# EAGLE design PIC PCB (EAGLE 9.6.2)
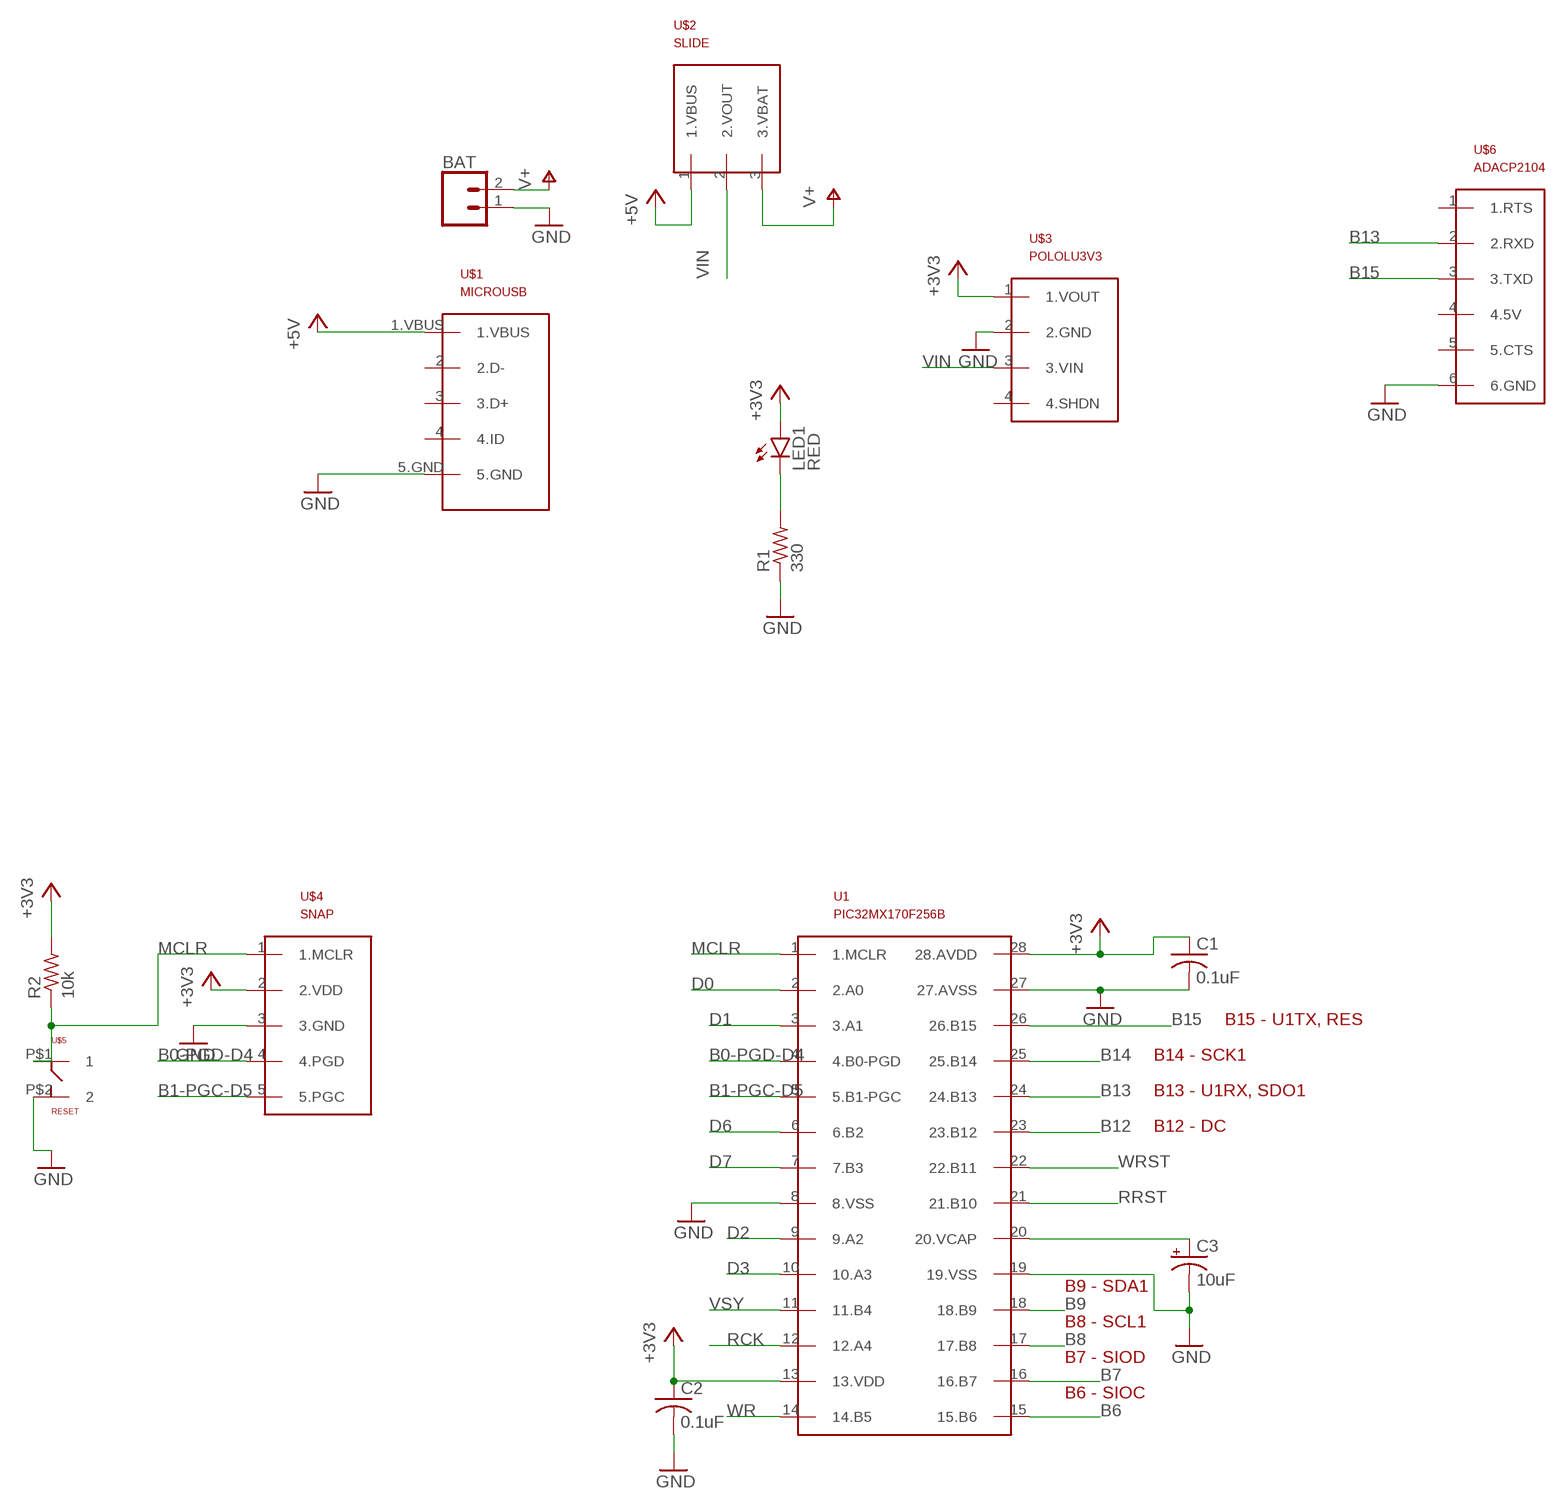
[diagram p0: schematic, sheet 1, part 1 of 2]
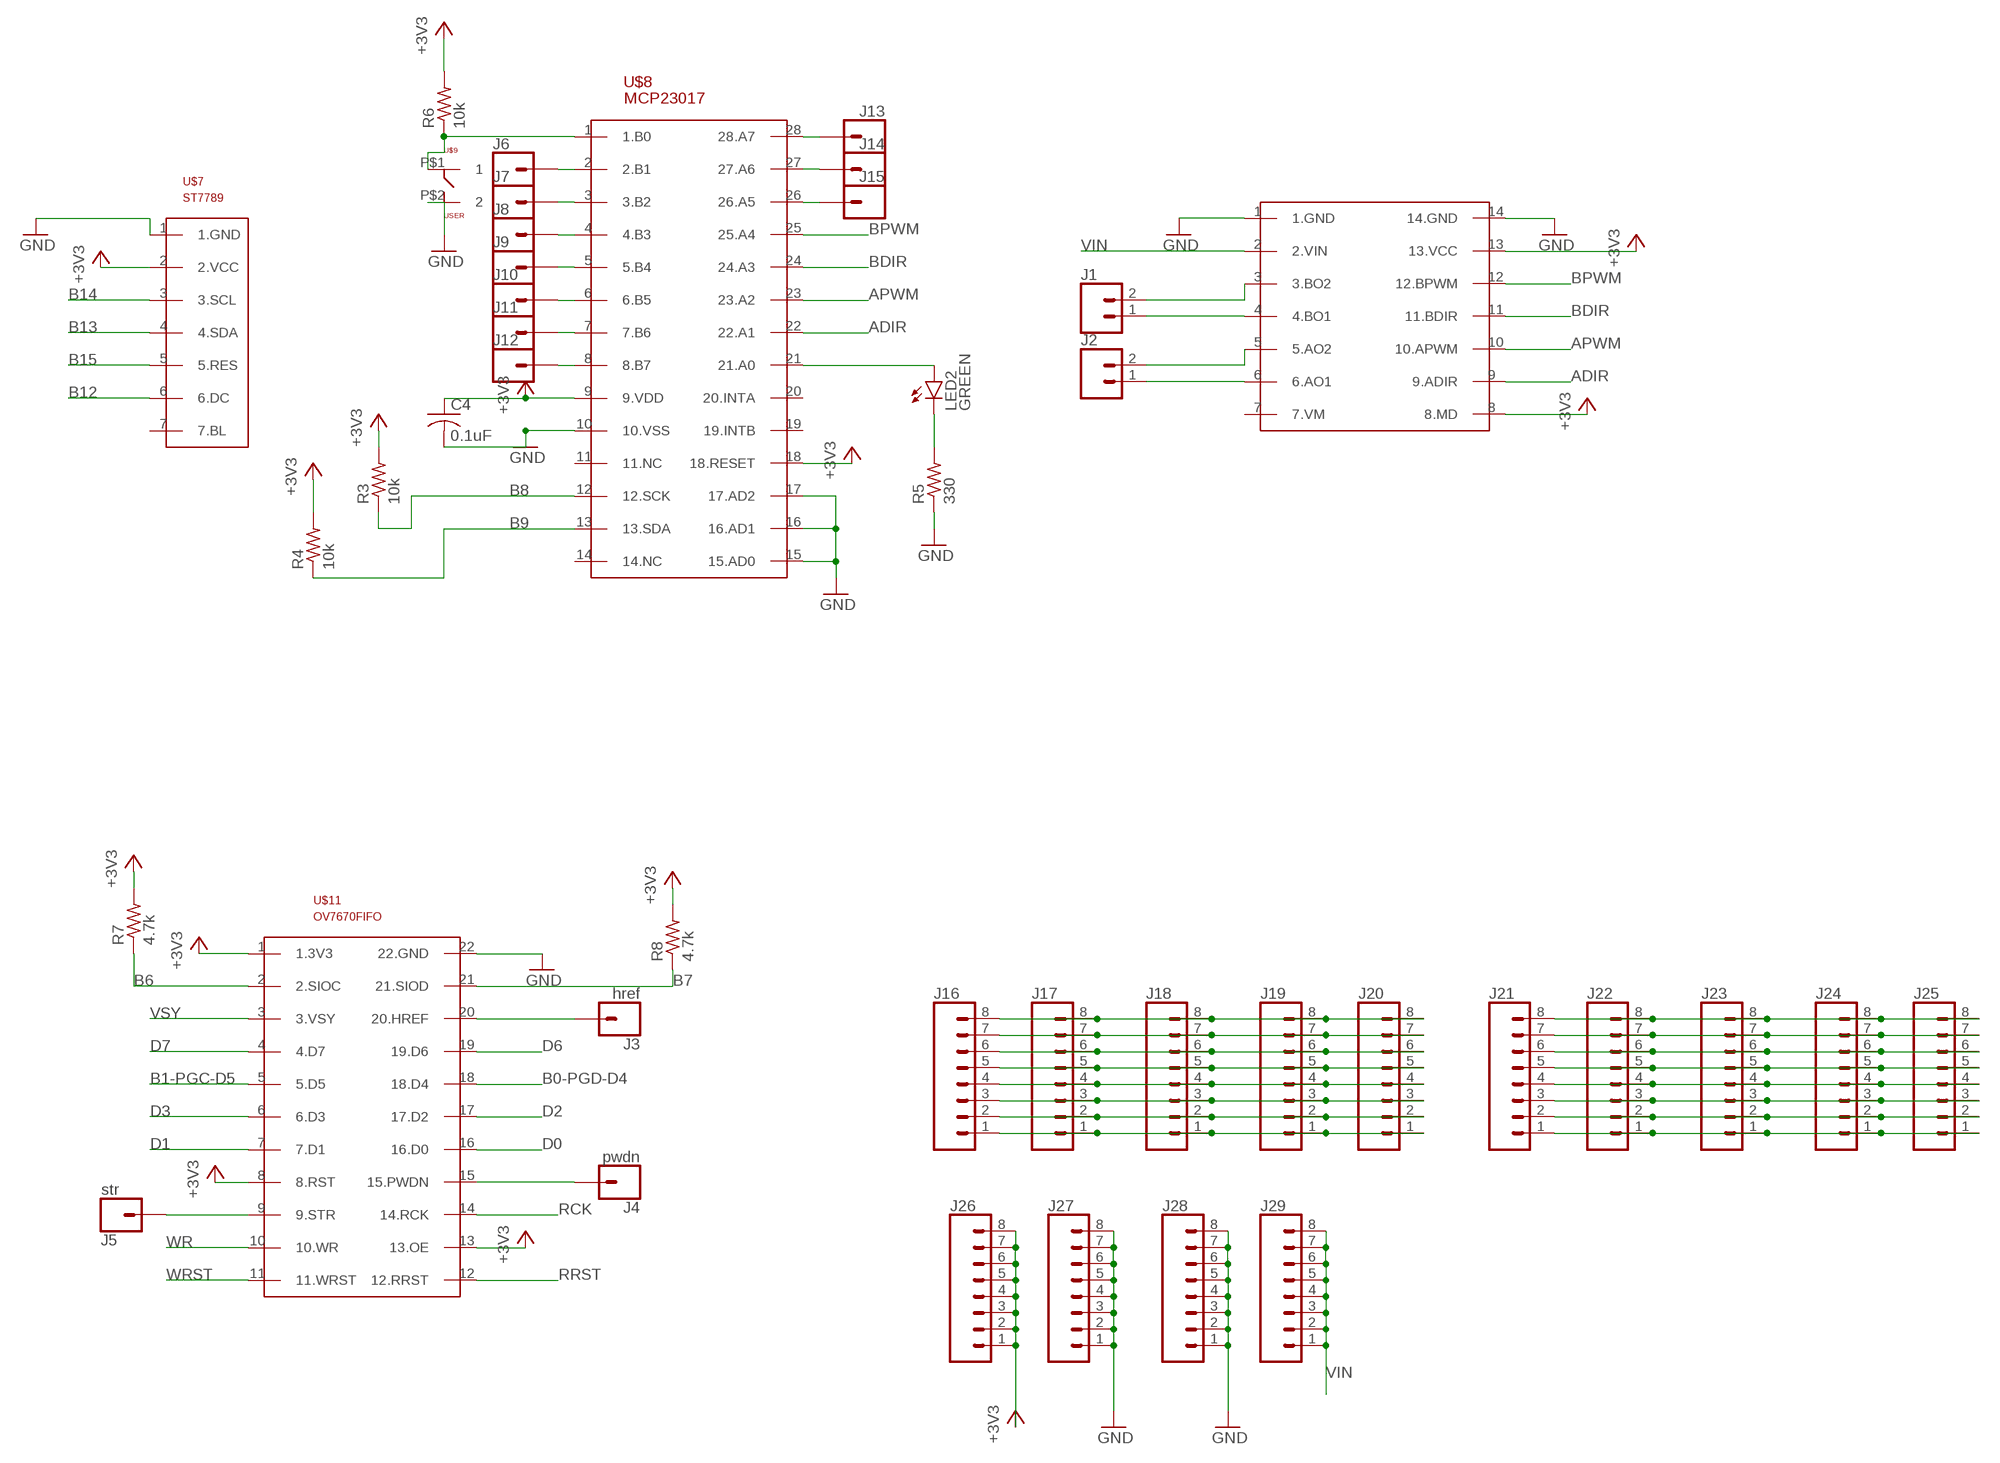
[diagram p1: schematic, sheet 1, part 2 of 2]

## Parts
BAT  CONN_02  [1X02]
C1  0.1uF  C-US025-030X050  [C025-030X050]
C2  0.1uF  C-US025-030X050  [C025-030X050]
C3  10uF  CPOL-USB45181B  [B45181B]
C4  0.1uF  C-US025-030X050  [C025-030X050]
J1  CONN_02  [1X02]
J2  CONN_02  [1X02]
J3  href  CONN_01  [1X01]
J4  pwdn  CONN_01  [1X01]
J5  str  CONN_01  [1X01]
J6  CONN_01  [1X01]
J7  CONN_01  [1X01]
J8  CONN_01  [1X01]
J9  CONN_01  [1X01]
J10  CONN_01  [1X01]
J11  CONN_01  [1X01]
J12  CONN_01  [1X01]
J13  CONN_01  [1X01]
J14  CONN_01  [1X01]
J15  CONN_01  [1X01]
J16  CONN_08"  [1X08]
J17  CONN_08"  [1X08]
J18  CONN_08"  [1X08]
J19  CONN_08"  [1X08]
J20  CONN_08"  [1X08]
J21  CONN_08"  [1X08]
J22  CONN_08"  [1X08]
J23  CONN_08"  [1X08]
J24  CONN_08"  [1X08]
J25  CONN_08"  [1X08]
J26  CONN_08"  [1X08]
J27  CONN_08"  [1X08]
J28  CONN_08"  [1X08]
J29  CONN_08"  [1X08]
LED1  RED  LED3MM  [LED3MM]
LED2  GREEN  LED3MM  [LED3MM]
R1  330  R-US_0207/10  [0207/10]
R2  10k  R-US_0207/10  [0207/10]
R3  10k  R-US_0207/10  [0207/10]
R4  10k  R-US_0207/10  [0207/10]
R5  330  R-US_0207/10  [0207/10]
R6  10k  R-US_0207/10  [0207/10]
R7  4.7k  R-US_0207/10  [0207/10]
R8  4.7k  R-US_0207/10  [0207/10]
U1  PIC32MX170F256B  [DIL28-3]
U$1  MICROUSB  [MICROUSB]
U$2  SLIDE  [SLIDE]
U$3  POLOLU3V3  [POLOLU3V3]
U$4  SNAP  [SNAP]
U$5  RESET  PUSH  [PUSH]
U$6  ADACP2104  [ADACP2104]
U$7  ST7789  [ST7789]
U$8  MCP23017  [MCP23017]
U$9  USER  PUSH  [PUSH]
U$10  POLOLUDRV8835  [POLOLUDRV8835]
U$11  OV7670FIFO  [OV7670FIFO]

## Nets
+3V3: C1.1 C2.1 C4.1 J26.1 J26.2 J26.3 J26.4 J26.5 J26.6 J26.7 J26.8 LED1.A R2.2 R3.2 R4.2 R6.2 R7.2 R8.2 U1.13(13.VDD) U1.28(28.AVDD) U$3.1(1.VOUT) U$4.2(2.VDD) U$7.2(2.VCC) U$8.9(9.VDD) U$8.18(18.RESET) U$10.8(8.MD) U$10.13(13.VCC) U$11.1(1.3V3) U$11.8(8.RST) U$11.13(13.OE)
+5V: U$1.1.VBUS U$2.1(1.VBUS)
ADIR: U$8.22(22.A1) U$10.9(9.ADIR)
APWM: U$8.23(23.A2) U$10.10(10.APWM)
B0-PGD-D4: U1.4(4.B0-PGD) U$4.4(4.PGD) U$11.18(18.D4)
B1-PGC-D5: U1.5(5.B1-PGC) U$4.5(5.PGC) U$11.5(5.D5)
B6: R7.1 U1.15(15.B6) U$11.2(2.SIOC)
B7: R8.1 U1.16(16.B7) U$11.21(21.SIOD)
B8: R3.1 U1.17(17.B8) U$8.12(12.SCK)
B9: R4.1 U1.18(18.B9) U$8.13(13.SDA)
B12: U1.23(23.B12) U$7.6(6.DC)
B13: U1.24(24.B13) U$6.2(2.RXD) U$7.4(4.SDA)
B14: U1.25(25.B14) U$7.3(3.SCL)
B15: U1.26(26.B15) U$6.3(3.TXD) U$7.5(5.RES)
BDIR: U$8.24(24.A3) U$10.11(11.BDIR)
BPWM: U$8.25(25.A4) U$10.12(12.BPWM)
D0: U1.2(2.A0) U$11.16(16.D0)
D1: U1.3(3.A1) U$11.7(7.D1)
D2: U1.9(9.A2) U$11.17(17.D2)
D3: U1.10(10.A3) U$11.6(6.D3)
D6: U1.6(6.B2) U$11.19(19.D6)
D7: U1.7(7.B3) U$11.4(4.D7)
GND: BAT.1 C1.2 C2.2 C3.- C4.2 J27.1 J27.2 J27.3 J27.4 J27.5 J27.6 J27.7 J27.8 J28.1 J28.2 J28.3 J28.4 J28.5 J28.6 J28.7 J28.8 R1.1 R5.1 U1.8(8.VSS) U1.19(19.VSS) U1.27(27.AVSS) U$1.5.GND U$3.2(2.GND) U$4.3(3.GND) U$5.P$2 U$6.6(6.GND) U$7.1(1.GND) U$8.10(10.VSS) U$8.15(15.AD0) U$8.16(16.AD1) U$8.17(17.AD2) U$9.P$2 U$10.1(1.GND) U$10.14(14.GND) U$11.22(22.GND)
MCLR: R2.1 U1.1(1.MCLR) U$4.1(1.MCLR) U$5.P$1
N$1: LED1.K(C) R1.2
N$2: C3.+ U1.20(20.VCAP)
N$3: J1.2 U$10.3(3.BO2)
N$4: LED2.A U$8.21(21.A0)
N$5: R6.1 U$8.1(1.B0) U$9.P$1
N$6: LED2.K(C) R5.2
N$7: J1.1 U$10.4(4.BO1)
N$8: J2.2 U$10.5(5.AO2)
N$9: J2.1 U$10.6(6.AO1)
N$10: J3.1 U$11.20(20.HREF)
N$11: J4.1 U$11.15(15.PWDN)
N$12: J5.1 U$11.9(9.STR)
N$13: J13.1 U$8.28(28.A7)
N$14: J14.1 U$8.27(27.A6)
N$15: J15.1 U$8.26(26.A5)
N$16: J6.1 U$8.2(2.B1)
N$17: J7.1 U$8.3(3.B2)
N$18: J8.1 U$8.4(4.B3)
N$19: J9.1 U$8.5(5.B4)
N$20: J10.1 U$8.6(6.B5)
N$21: J11.1 U$8.7(7.B6)
N$22: J12.1 U$8.8(8.B7)
N$23: J16.8 J17.8 J18.8 J19.8 J20.8
N$24: J16.7 J17.7 J18.7 J19.7 J20.7
N$25: J16.6 J17.6 J18.6 J19.6 J20.6
N$26: J16.5 J17.5 J18.5 J19.5 J20.5
N$27: J16.4 J17.4 J18.4 J19.4 J20.4
N$28: J16.3 J17.3 J18.3 J19.3 J20.3
N$29: J16.2 J17.2 J18.2 J19.2 J20.2
N$30: J16.1 J17.1 J18.1 J19.1 J20.1
N$31: J21.8 J22.8 J23.8 J24.8 J25.8
N$32: J21.7 J22.7 J23.7 J24.7 J25.7
N$33: J21.6 J22.6 J23.6 J24.6 J25.6
N$34: J21.5 J22.5 J23.5 J24.5 J25.5
N$35: J21.4 J22.4 J23.4 J24.4 J25.4
N$36: J21.3 J22.3 J23.3 J24.3 J25.3
N$37: J21.2 J22.2 J23.2 J24.2 J25.2
N$38: J21.1 J22.1 J23.1 J24.1 J25.1
RCK: U1.12(12.A4) U$11.14(14.RCK)
RRST: U1.21(21.B10) U$11.12(12.RRST)
V+: BAT.2 U$2.3(3.VBAT)
VIN: J29.1 J29.2 J29.3 J29.4 J29.5 J29.6 J29.7 J29.8 U$2.2(2.VOUT) U$3.3(3.VIN) U$10.2(2.VIN)
VSY: U1.11(11.B4) U$11.3(3.VSY)
WR: U1.14(14.B5) U$11.10(10.WR)
WRST: U1.22(22.B11) U$11.11(11.WRST)
Unconnected: U$1.2(2.D-) U$1.3(3.D+) U$1.4(4.ID) U$3.4(4.SHDN) U$6.1(1.RTS) U$6.4(4.5V) U$6.5(5.CTS) U$7.7(7.BL) U$8.11(11.NC) U$8.14(14.NC) U$8.19(19.INTB) U$8.20(20.INTA) U$10.7(7.VM)

## Notes on the sheet
- B15 - U1TX, RES
- B14 - SCK1
- B13 - U1RX, SDO1
- B12 - DC
- B9 - SDA1
- B8 - SCL1
- B7 - SIOD
- B6 - SIOC

## Library data of the parts
BAT J1 J2 = PIC PCB:CONN_02: Multi connection point. Often used as Generic Header-pin footprint for 0.1 inch spaced/style header connections On any of the 0.1 inch spaced packages, you can populate with these: Break Away Headers - Straight <https://www.sparkfun.com/products/116> (PRT-00116) Break Away Male Headers - Right Angle <https://www.sparkfun.com/products/553> (PRT-00553) Female Headers <https://www.sparkfun.com/products/115> (PRT-00115) Break Away Headers - Machine Pin <https://www.sparkfun.com/products/117> (PRT-00117) Break Away Female Headers - Swiss Machine Pin <https://www.sparkfun.com/products/743> (PRT-00743) For SCREWTERMINALS and SPRING TERMINALS visit here: Screw Terimnals on SparkFun.com <https://www.sparkfun.com/search/results?term=Screw+Terminals> (5mm/3.5mm/2.54mm spacing) This device is also useful as a general connection point to wire up your design to another part of your project. Our various solder wires solder well into these plated through hole pads. Hook-Up Wire - Assortment (Stranded, 22 AWG) <https://www.sparkfun.com/products/11375> (PRT-11375) Hook-Up Wire - Assortment (Solid Core, 22 AWG) <https://www.sparkfun.com/products/11367> (PRT-11367) View the entire wire category on our website here <https://www.sparkfun.com/categories/141> Special notes: Molex polarized connector foot print use with: PRT-08233 with associated crimp pins and housings. 2.54_SCREWTERM for use with PRT-10571. 3.5mm Screw Terminal footprints for PRT-08084 5mm Screw Terminal footprints for use with PRT-08432
C1 C2 C4 = PIC PCB:C-US: CAPACITOR, American symbol; SPICEPREFIX: C
C3 = PIC PCB:CPOL-US: POLARIZED CAPACITOR, American symbol; SPICEPREFIX: C
J3-J15 = PIC PCB:CONN_01: Single connection point. Often used as Generic Header-pin footprint for 0.1 inch spaced/style header connections On any of the 0.1 inch spaced packages, you can populate with these: Break Away Headers - Straight <https://www.sparkfun.com/products/116> (PRT-00116) Break Away Male Headers - Right Angle <https://www.sparkfun.com/products/553> (PRT-00553) Female Headers <https://www.sparkfun.com/products/115> (PRT-00115) Break Away Headers - Machine Pin <https://www.sparkfun.com/products/117> (PRT-00117) Break Away Female Headers - Swiss Machine Pin <https://www.sparkfun.com/products/743> (PRT-00743) This device is also useful as a general connection point to wire up your design to another part of your project. Our various solder wires solder well into these plated through hole pads. Hook-Up Wire - Assortment (Stranded, 22 AWG) <https://www.sparkfun.com/products/11375> (PRT-11375) Hook-Up Wire - Assortment (Solid Core, 22 AWG) <https://www.sparkfun.com/products/11367> (PRT-11367) View the entire wire category on our website here <https://www.sparkfun.com/categories/141> Special notes: SMTSO-256-ET is a "flush mount" nut for a 4-40 screw. We mostly use this on specialty testbeds; it is a nice way to connect hardware to your PCB at an adjustable hieght. Also note, the SNAP packages are for using a snappable style connector. We sell a baggie of snaps and they are also used on two LilyPad designs: Snap Assortment - 30 pack (male and female) <https://www.sparkfun.com/products/11347> (DEV-11347) LilyPad Arduino SimpleSnap <https://www.sparkfun.com/products/10941> (DEV-10941) LilyPad SimpleSnap Protoboard <https://www.sparkfun.com/products/10940> (DEV-10940)
J16-J29 = PIC PCB:CONN_08: Multi connection point. Often used as Generic Header-pin footprint for 0.1 inch spaced/style header connections On any of the 0.1 inch spaced packages, you can populate with these: Break Away Headers - Straight <https://www.sparkfun.com/products/116> (PRT-00116) Break Away Male Headers - Right Angle <https://www.sparkfun.com/products/553> (PRT-00553) Female Headers <https://www.sparkfun.com/products/115> (PRT-00115) Break Away Headers - Machine Pin <https://www.sparkfun.com/products/117> (PRT-00117) Break Away Female Headers - Swiss Machine Pin <https://www.sparkfun.com/products/743> (PRT-00743) Arduino Stackable Header - 8 Pin <https://www.sparkfun.com/products/9279> (PRT-09279) For SCREWTERMINALS and SPRING TERMINALS visit here: Screw Terimnals on SparkFun.com <https://www.sparkfun.com/search/results?term=Screw+Terminals> (5mm/3.5mm/2.54mm spacing) This device is also useful as a general connection point to wire up your design to another part of your project. Our various solder wires solder well into these plated through hole pads. Hook-Up Wire - Assortment (Stranded, 22 AWG) <https://www.sparkfun.com/products/11375> (PRT-11375) Hook-Up Wire - Assortment (Solid Core, 22 AWG) <https://www.sparkfun.com/products/11367> (PRT-11367) View the entire wire category on our website here <https://www.sparkfun.com/categories/141> Special notes: Molex polarized connector foot print use with SKU : PRT-08231 with associated crimp pins and housings. 1MM SMD Version SKU: PRT-10208 NOTES ON THE VARIANTS LOCK and LOCK_LONGPADS... This footprint was designed to help hold the alignment of a through-hole component (i.e. 6-pin header) while soldering it into place. You may notice that each hole has been shifted either up or down by 0.005 of an inch from it's more standard position (which is a perfectly straight line). This slight alteration caused the pins (the squares in the middle) to touch the edges of the holes. Because they are alternating, it causes a "brace" to hold the component in place. 0.005 has proven to be the perfect amount of "off-center" position when using our standard breakaway headers. Although looks a little odd when you look at the bare footprint, once you have a header in there, the alteration is very hard to notice. Also,if you push a header all the way into place, it is covered up entirely on the bottom side.; PROD_ID: CONN-08438
LED1 LED2 = PIC PCB:LED: LED OSRAM: - CHIPLED LG R971, LG N971, LY N971, LG Q971, LY Q971, LO R971, LY R971 LH N974, LH R974 LS Q976, LO Q976, LY Q976 LO Q996 - Hyper CHIPLED LW Q18S LB Q993, LB Q99A, LB R99A - SideLED LS A670, LO A670, LY A670, LG A670, LP A670 LB A673, LV A673, LT A673, LW A673 LH A674 LY A675 LS A676, LA A676, LO A676, LY A676, LW A676 LS A679, LY A679, LG A679 - Hyper Micro SIDELED® LS Y876, LA Y876, LO Y876, LY Y876 LT Y87S - SmartLED LW L88C, LW L88S LB L89C, LB L89S, LG L890 LS L89K, LO L89K, LY L89K LS L896, LA L896, LO L896, LY L896 - TOPLED LS T670, LO T670, LY T670, LG T670, LP T670 LSG T670, LSP T670, LSY T670, LOP T670, LYG T670 LG T671, LOG T671, LSG T671 LB T673, LV T673, LT T673, LW T673 LH T674 LS T676, LA T676, LO T676, LY T676, LB T676, LH T676, LSB T676, LW T676 LB T67C, LV T67C, LT T67C, LS T67K, LO T67K, LY T67K, LW E67C LS E67B, LA E67B, LO E67B, LY E67B, LB E67C, LV E67C, LT E67C LW T67C LS T679, LY T679, LG T679 LS T770, LO T770, LY T770, LG T770, LP T770 LB T773, LV T773, LT T773, LW T773 LH T774 LS E675, LA E675, LY E675, LS T675 LS T776, LA T776, LO T776, LY T776, LB T776 LHGB T686 LT T68C, LB T68C - Hyper Mini TOPLED® LB M676 - Mini TOPLED Santana® LG M470 LS M47K, LO M47K, LY M47K Source: http://www.osram.convergy.de LUXEON: - LUMILED® LXK2-PW12-R00, LXK2-PW12-S00, LXK2-PW14-U00, LXK2-PW14-V00 LXK2-PM12-R00, LXK2-PM12-S00, LXK2-PM14-U00 LXK2-PE12-Q00, LXK2-PE12-R00, LXK2-PE12-S00, LXK2-PE14-T00, LXK2-PE14-U00 LXK2-PB12-K00, LXK2-PB12-L00, LXK2-PB12-M00, LXK2-PB14-N00, LXK2-PB14-P00, LXK2-PB14-Q00 LXK2-PR12-L00, LXK2-PR12-M00, LXK2-PR14-Q00, LXK2-PR14-R00 LXK2-PD12-Q00, LXK2-PD12-R00, LXK2-PD12-S00 LXK2-PH12-R00, LXK2-PH12-S00 LXK2-PL12-P00, LXK2-PL12-Q00, LXK2-PL12-R00 Source: www.luxeon.com KINGBRIGHT: KA-3528ASYC Source: www.kingbright.com
R1-R8 = PIC PCB:R-US_: RESISTOR, American symbol; SPICEPREFIX: R
U1 = PIC PCB:PIC32MX170F256B
U$1 = PIC PCB:MICROUSB
U$2 = PIC PCB:SLIDE
U$3 = PIC PCB:POLOLU3V3
U$4 = PIC PCB:SNAP
U$5 U$9 = PIC PCB:PUSH
U$6 = PIC PCB:ADACP2104
U$7 = PIC PCB:ST7789
U$8 = PIC PCB:MCP23017
U$10 = PIC PCB:POLOLUDRV8835
U$11 = PIC PCB:OV7670FIFO

## Board
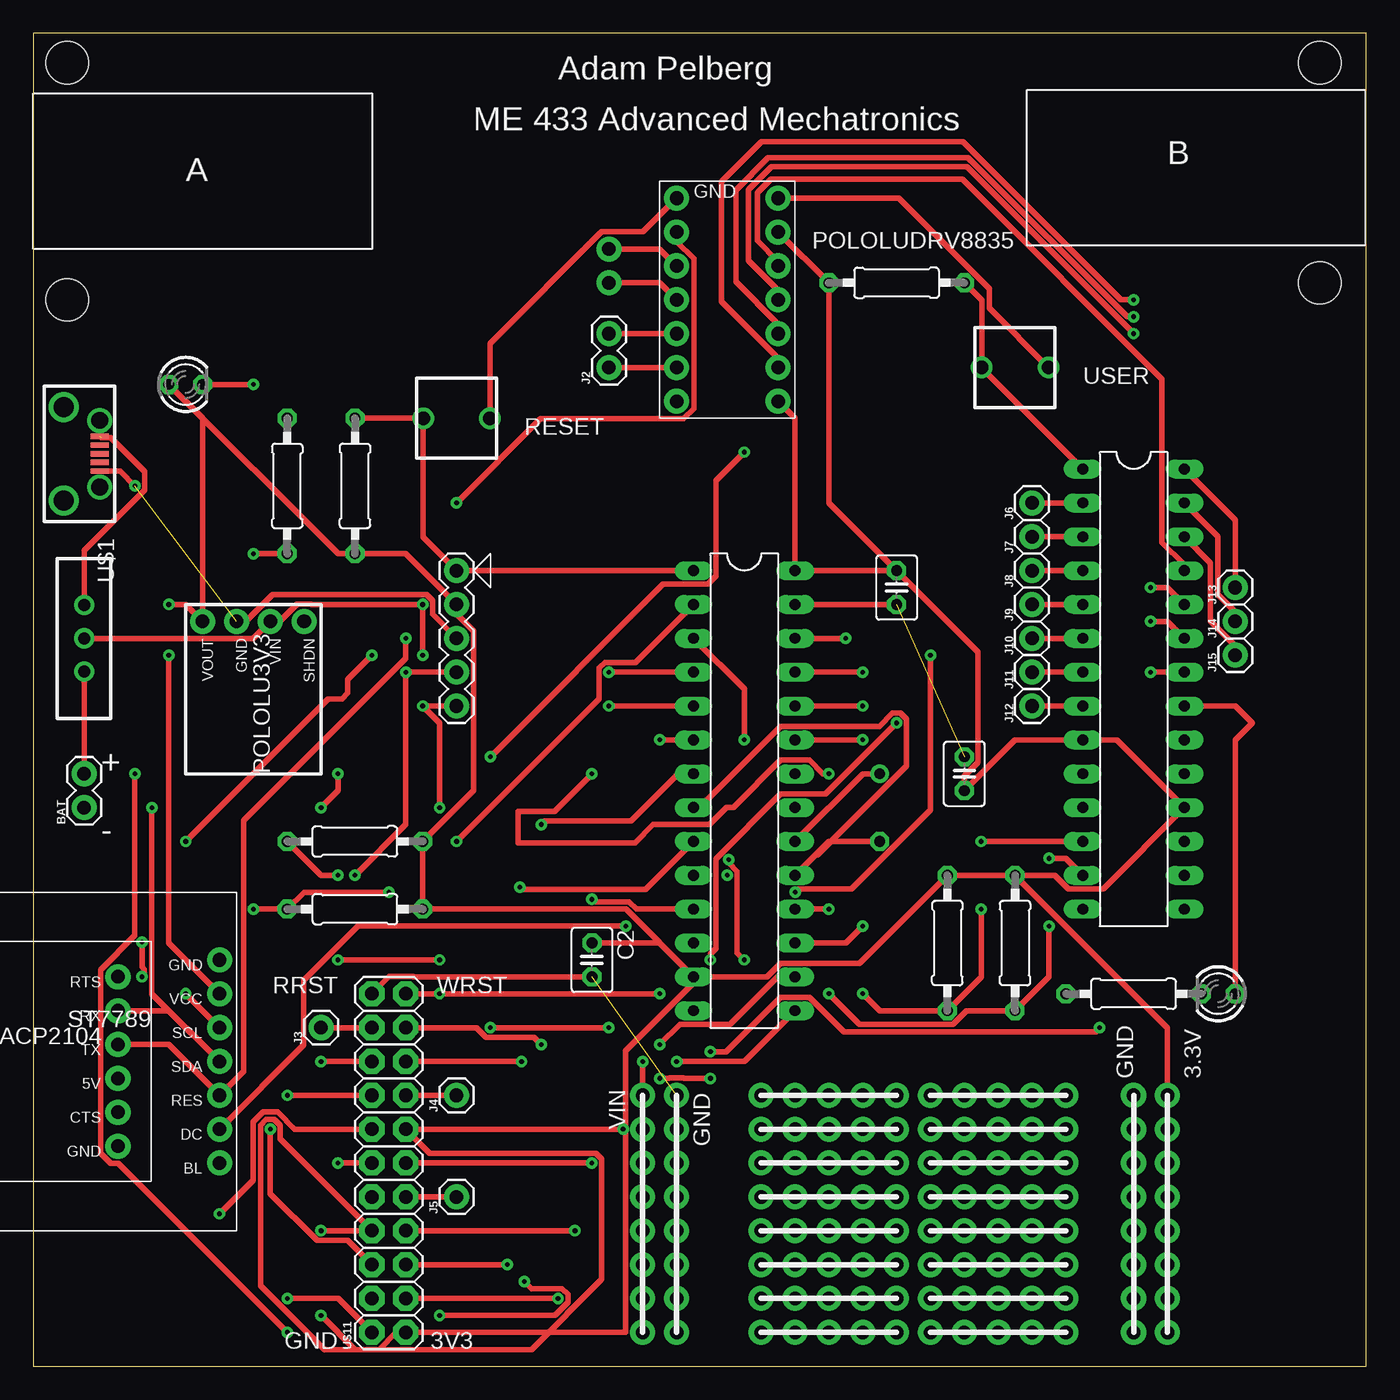
[diagram p2: board, top side]
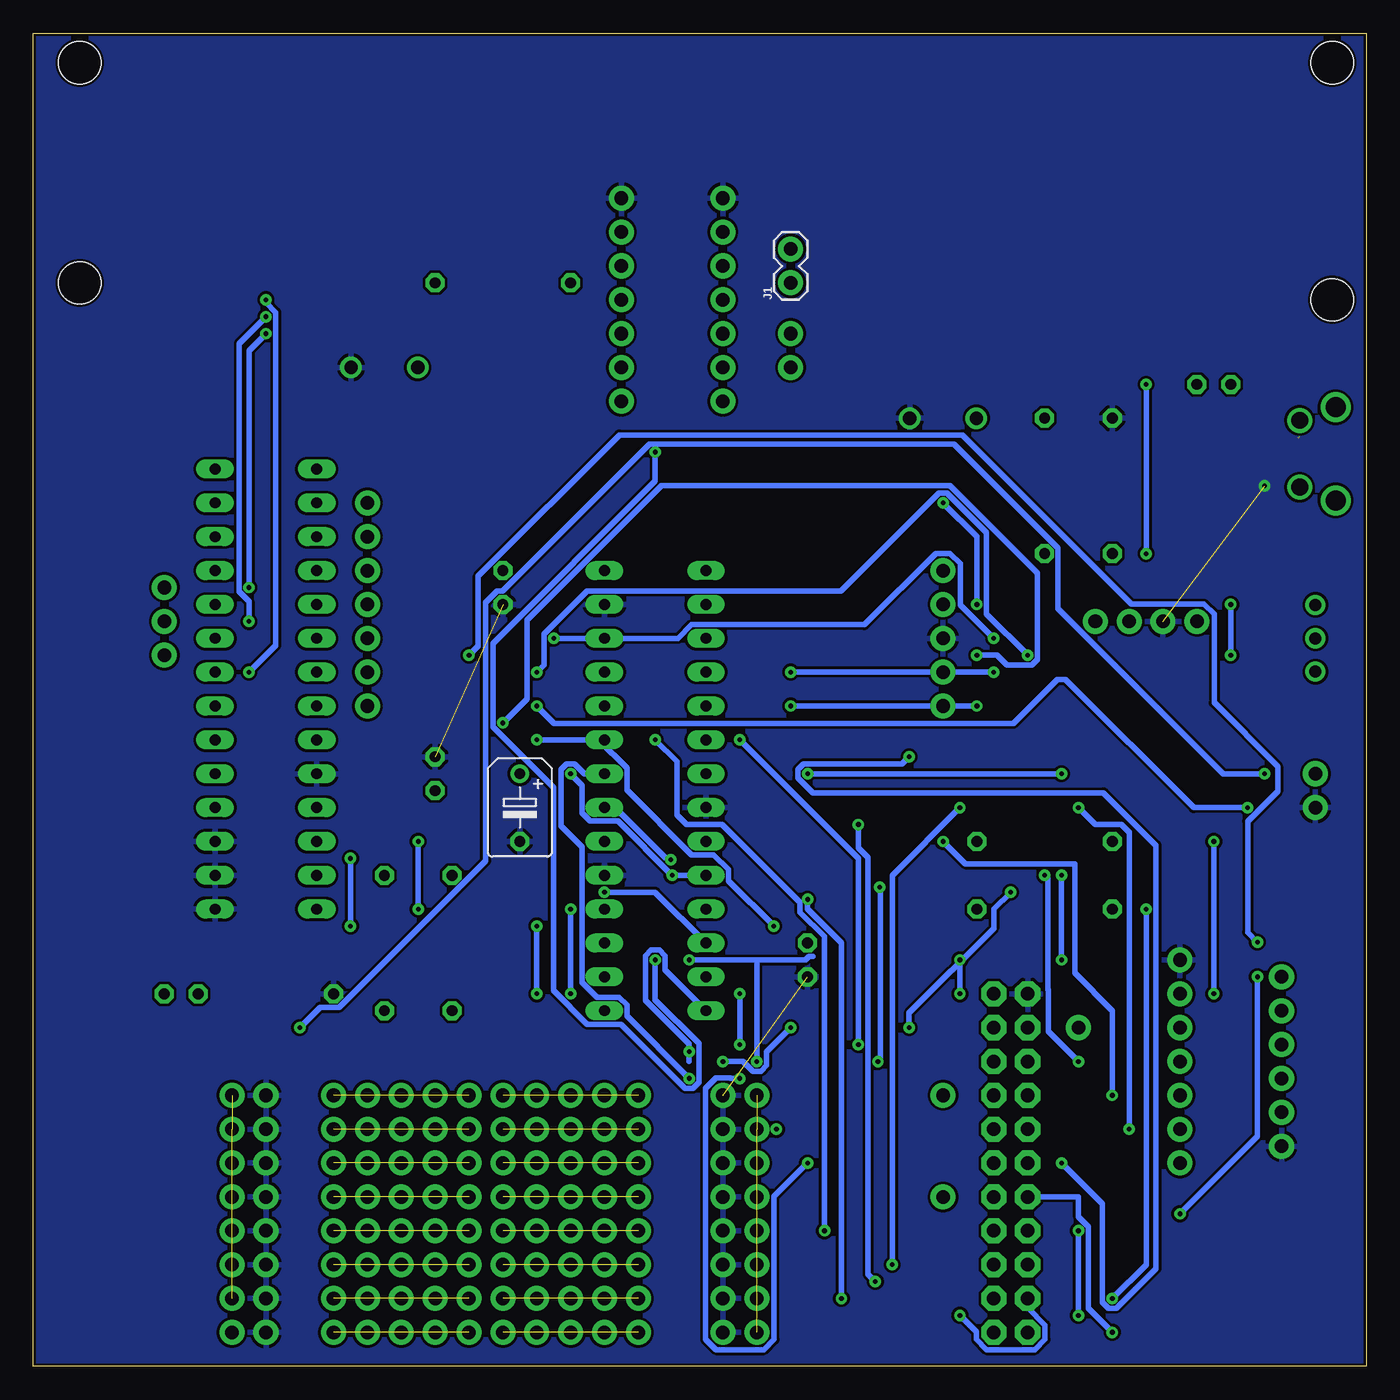
[diagram p3: board, bottom side, seen from below]

Size 100 x 100 mm. Coordinates in mm from the lower left corner, seen from the top.
Outline: 0,0 100,0 100,100 0,100 0,0
Copper layers (1*16): Top 0.035mm / dielectric 1.5mm / Bottom 0.035mm
Design rules "SparkFun": minimum track width 8mil, minimum drill 20mil, track to track 8mil, track to pad 8mil, pad to pad 8mil, via to via 8mil, smd to smd 8mil, copper to edge 8mil, drill to drill 8mil, minimum pad ring 12mil, minimum via ring 10mil, stop-mask expansion 4mil, vias tented up to drill 20mil, thermal gap 10mil
Holes 3.17 mm at 2.54,97.79 2.54,80.01 96.52,97.79 96.52,81.28

### Footprints (pad centres in the part's own frame; a part is rotated, then mirrored left to right if it is on the bottom)
1X02 = drill 1.016 pad 1.88: 1 0,0; 2 2.54,0
C025-030X050 = drill 0.813 octagon: 1 -1.27,0; 2 1.27,0
B45181B = drill 0.813: + -2.54,0 | drill 0.813 octagon: - 2.54,0
1X01 = drill 1.016 pad 1.88: 1 0,0
1X08 = drill 1.016 pad 1.88: 1 0,0; 2 2.54,0; 3 5.08,0; 4 7.62,0; 5 10.16,0; 6 12.7,0; 7 15.24,0; 8 17.78,0
LED3MM = drill 0.813 octagon: A -1.27,0; K 1.27,0
0207/10 = drill 0.813 octagon: 1 -5.08,0; 2 5.08,0
DIL28-3 = drill 0.813 long: 1 -16.51,-3.81; 2 -13.97,-3.81; 3 -11.43,-3.81; 4 -8.89,-3.81; 5 -6.35,-3.81; 6 -3.81,-3.81; 7 -1.27,-3.81; 8 1.27,-3.81; 9 3.81,-3.81; 10 6.35,-3.81; 11 8.89,-3.81; 12 11.43,-3.81; 13 13.97,-3.81; 14 16.51,-3.81; 15 16.51,3.81; 16 13.97,3.81; 17 11.43,3.81; 18 8.89,3.81; 19 6.35,3.81; 20 3.81,3.81; 21 1.27,3.81; 22 -1.27,3.81; 23 -3.81,3.81; 24 -6.35,3.81; 25 -8.89,3.81; 26 -11.43,3.81; 27 -13.97,3.81; 28 -16.51,3.81
MICROUSB = smd 0.4 x 1.35: 1.VBUS -1.3,2.7; 2 -0.65,2.7; 3 0,2.7; 4 0.65,2.7; 5.GND 1.3,2.7 | drill 1.25 pad 1.676: P$6 -2.5,2.7; P$7 2.5,2.7 | drill 1.5: P$8 -3.5,0; P$9 3.5,0
SLIDE = drill 0.9: 1 -2.5,0; 2 0,0; 3 2.5,0
POLOLU3V3 = drill 1.016 pad 1.88: 1 0,3.81; 2 0,1.27; 3 0,-1.27; 4 0,-3.81
SNAP = drill 1.016 pad 1.88: 1 0,5.08; 2 0,2.54; 3 0,0; 4 0,-2.54; 5 0,-5.08
PUSH = drill 1: P$1 -2.5,0; P$2 2.5,0
ADACP2104 = drill 1.016 pad 1.88: 1 0,6.35; 2 0,3.81; 3 0,1.27; 4 0,-1.27; 5 0,-3.81; 6 0,-6.35
ST7789 = drill 1.016 pad 1.88: 1 0,7.62; 2 0,5.08; 3 0,2.54; 4 0,0; 5 0,-2.54; 6 0,-5.08; 7 0,-7.62
MCP23017 = drill 0.813 long: 1 -16.51,-3.81; 2 -13.97,-3.81; 3 -11.43,-3.81; 4 -8.89,-3.81; 5 -6.35,-3.81; 6 -3.81,-3.81; 7 -1.27,-3.81; 8 1.27,-3.81; 9 3.81,-3.81; 10 6.35,-3.81; 11 8.89,-3.81; 12 11.43,-3.81; 13 13.97,-3.81; 14 16.51,-3.81; 15 16.51,3.81; 16 13.97,3.81; 17 11.43,3.81; 18 8.89,3.81; 19 6.35,3.81; 20 3.81,3.81; 21 1.27,3.81; 22 -1.27,3.81; 23 -3.81,3.81; 24 -6.35,3.81; 25 -8.89,3.81; 26 -11.43,3.81; 27 -13.97,3.81; 28 -16.51,3.81
POLOLUDRV8835 = drill 1.016 pad 1.88: 1 -3.81,7.62; 2 -3.81,5.08; 3 -3.81,2.54; 4 -3.81,0; 5 -3.81,-2.54; 6 -3.81,-5.08; 7 -3.81,-7.62; 8 3.81,-7.62; 9 3.81,-5.08; 10 3.81,-2.54; 11 3.81,0; 12 3.81,2.54; 13 3.81,5.08; 14 3.81,7.62
OV7670FIFO = drill 1.016 pad 1.88 octagon: 1 -1.27,12.7; 2 1.27,12.7; 3 -1.27,10.16; 4 1.27,10.16; 5 -1.27,7.62; 6 1.27,7.62; 7 -1.27,5.08; 8 1.27,5.08; 9 -1.27,2.54; 10 1.27,2.54; 11 -1.27,0; 12 1.27,0; 13 -1.27,-2.54; 14 1.27,-2.54; 15 -1.27,-5.08; 16 1.27,-5.08; 17 -1.27,-7.62; 18 1.27,-7.62; 19 -1.27,-10.16; 20 1.27,-10.16; 21 -1.27,-12.7; 22 1.27,-12.7

### Placement (x,y rotation side)
BAT  3.81,41.91 90 top
C1  64.77,58.42 270 top
C2  41.91,30.48 270 top
C3  63.5,41.91 270 bottom
C4  69.85,44.45 90 top
J1  43.18,81.28 90 bottom
J2  43.18,74.93 90 top
J3  21.59,25.4 90 top
J4  31.75,20.32 90 top
J5  31.75,12.7 90 top
J6  74.93,64.77 90 top
J7  74.93,62.23 90 top
J8  74.93,59.69 90 top
J9  74.93,57.15 90 top
J10  74.93,54.61 90 top
J11  74.93,52.07 90 top
J12  74.93,49.53 90 top
J13  90.17,58.42 90 top
J14  90.17,55.88 90 top
J15  90.17,53.34 90 top
J16  54.61,20.32 270 top
J17  57.15,20.32 270 top
J18  59.69,20.32 270 top
J19  62.23,20.32 270 top
J20  64.77,20.32 270 top
J21  67.31,20.32 270 top
J22  69.85,20.32 270 top
J23  72.39,20.32 270 top
J24  74.93,20.32 270 top
J25  77.47,20.32 270 top
J26  85.09,2.54 90 top
J27  48.26,2.54 90 top
J28  82.55,2.54 90 top
J29  45.72,2.54 90 top
LED1  11.43,73.66 0 top
LED2  88.9,27.94 180 top
R1  19.05,66.04 270 top
R2  24.13,66.04 270 top
R3  68.58,31.75 90 top
R4  73.66,31.75 90 top
R5  82.55,27.94 0 top
R6  64.77,81.28 180 top
R7  24.13,34.29 0 top
R8  24.13,39.37 0 top
U1  53.34,43.18 270 top
U$1  2.29,68.45 270 top
U$2  3.81,54.61 270 top
U$3  16.51,55.88 90 top
U$4  31.75,54.61 0 top
U$5  31.75,71.12 0 top
U$6  6.35,22.86 0 top
U$7  13.97,22.86 0 top
U$8  82.55,50.8 270 top
U$9  73.66,74.93 0 top
U$10  52.07,80.01 0 top
U$11  26.67,15.24 180 top

### Tracks (layer width: path | path; a pad name or v marks a point on that pad's centre or on a via)
+3V3  (via drill 0.35)  (6 unrouted)
  Top 0.406: U1.13 44.45,34.29 R7.2 R8.2 33.05,43.2 33.05,55.15 31.75,56.44 U$4.2 27.94,60.96 R2.2 22.86,60.96 LED1.A 12.7,71.12 U$3.1 11.43,57.15 v10.16,57.15 | U1.13 55.05,29.21 56.07,30.23 61.98,30.23 R3.2 R4.2 | U$10.8 57.15,71.12 U1.28 C1.1 | C1.1 59.69,64.77 R6.2 U$10.13 | C1.1 70.87,53.59 70.87,45.3 69.85,44.28 C4.1 73.66,46.99 U$8.9 81.28,46.99 U$8.18 80.26,35.81 77.66,35.81 76.64,36.83 R4.2 | R4.2 85.09,25.4 J26.8 J26.1 | U1.13 49.53,28.77 44.42,23.66 44.42,2.54 U$11.1 27.23,2.54 25.94,1.25 | 25.94,1.25 24.16,1.25 | 24.16,1.25 v21.59,3.81 | v21.59,10.16 U$11.8 18.51,17.05 18.51,18.08 18.08,18.51 17.48,18.51 17.05,18.08 17.05,6.05 21.85,1.25 24.16,1.25 | C2.1 46.99,31.75 U1.13 | U$7.2 10.16,31.75 v10.16,53.34 | v44.25,17.78 U$11.13 29.75,15.97 42.21,15.97 42.64,15.54 42.64,6.53 37.36,1.25 25.94,1.25
  Bottom 0.406: v21.59,3.81 v21.59,10.16 | v10.16,53.34 v10.16,57.15
+5V  (1 unrouted)
  Top 0.406: 5.08,69.66 5.81,69.66 8.35,67.11 8.35,65.74 3.81,61.19 U$2.1
ADIR  (via drill 0.35)
  Top 0.406: v82.55,80.01 81.59,80.01 69.73,91.87 54.65,91.87 51.64,88.86 51.64,79.88 55.88,75.64 U$10.9 | v83.82,52.07 U$8.22
  Bottom 0.406: v82.55,80.01 82.55,79.78 81.82,79.04 81.82,54.07 v83.82,52.07
APWM  (via drill 0.35)
  Top 0.406: v82.55,78.74 82.07,78.74 70.13,90.68 55.13,90.68 52.7,88.25 52.7,81.35 55.88,78.18 U$10.10 | v83.82,55.88 85.09,55.88 U$8.23
  Bottom 0.406: v83.82,55.88 83.82,57.38 84.55,58.12 84.55,76.74 v82.55,78.74
B0-PGD-D4  (via drill 0.35)
  Top 0.406: U$4.4 v27.94,52.07 27.94,40.64 v24.13,36.83 | v43.18,52.07 U1.4 | v21.59,22.86 U$11.18
  Bottom 0.406: v27.94,52.07 v43.18,52.07 | v24.13,36.83 23.88,36.58 23.88,28.25 23.85,28.22 23.85,25.12 v21.59,22.86
  other vias: 31.75,52.07 31.75,52.07
B1-PGC-D5  (via drill 0.35)
  Top 0.406: U$4.5 v29.21,49.53 30.48,48.26 v30.48,41.91 | v43.18,49.53 U1.5 | U$11.5 v35.56,7.62
  Bottom 0.406: v29.21,49.53 v43.18,49.53 | v30.48,41.91 35.56,36.83 v35.56,7.62
B6  (via drill 0.35)
  Top 0.406: U$11.2 22.86,5.08 v19.05,5.08 | v16.51,34.29 R7.1 20.32,35.56 v26.67,35.56 | v34.29,25.4 v43.18,25.4 | v48.26,22.86 53.34,22.86 U1.15
  Bottom 0.406: v19.05,5.08 16.51,7.62 v16.51,34.29 | v26.67,35.56 27.94,34.29 27.94,32.85 34.29,26.5 v34.29,25.4 | v48.26,22.86 46.76,22.86 46.02,22.13 45.42,22.13 44.99,22.56 44.99,23.59 v43.18,25.4
B7  (via drill 0.35)
  Top 0.406: R8.1 21.59,36.83 v22.86,36.83 | v22.86,30.48 v30.48,30.48 | U$11.21 v30.48,27.94 v46.99,27.94 | v46.99,24.13 48.51,25.65 52.29,25.65 55.84,29.21 U1.16
  Bottom 0.406: v22.86,36.83 v22.86,30.48 | v30.48,30.48 v30.48,27.94 | v46.99,27.94 v46.99,24.13
B8  (via drill 0.35)
  Top 0.406: v62.23,27.94 63.5,26.67 R3.1 71.12,29.21 v71.12,34.29 | v62.23,33.02 60.96,31.75 U1.17 | v71.12,39.37 U$8.12
  Bottom 0.406: v62.23,27.94 v62.23,33.02 | v71.12,34.29 v71.12,39.37
B9  (via drill 0.35)
  Top 0.406: v76.2,33.02 76.2,29.21 R4.1 70.02,26.67 69,25.65 61.98,25.65 v59.69,27.94 | v76.2,38.1 77.47,38.1 U$8.13 | v59.69,34.29 U1.18
  Bottom 0.406: v76.2,33.02 v76.2,38.1 | v59.69,27.94 v59.69,34.29
B12  (via drill 0.35)
  Top 0.406: U$7.6 20.3,24.11 20.3,28.95 24.36,33.02 v44.45,33.02 | v62.23,46.99 U1.23
  Bottom 0.406: v44.45,33.02 47.85,36.42 47.85,37.25 48.96,38.35 50.61,38.35 55.47,43.22 55.47,44.87 57.59,46.99 v62.23,46.99
B13  (via drill 0.35)
  Top 0.406: U$6.2 10.16,26.67 U$7.4 8.89,27.94 v8.89,41.91 | v62.23,49.53 U1.24
  Bottom 0.406: v8.89,41.91 12.93,41.91 22.56,51.53 23.16,51.53 26.46,48.23 60.94,48.23 v62.23,49.53
B14  (via drill 0.35)
  Top 0.406: U$7.3 v11.43,27.94 | v11.43,39.37 22.13,50.07 23.16,50.07 23.59,50.5 23.59,51.53 v25.4,53.34 | v62.23,52.07 U1.25
  Bottom 0.406: v11.43,27.94 v11.43,39.37 | v25.4,53.34 28.48,56.42 28.48,62.53 31.45,65.5 32.05,65.5 39.39,58.17 58.44,58.17 61.69,54.91 61.69,52.61 v62.23,52.07
B15  (via drill 0.35)
  Top 0.406: U$6.3 10.16,24.13 U$7.5 15.78,22.13 15.78,40.94 27.94,53.11 v27.94,54.61 | v60.96,54.61 U1.26
  Bottom 0.406: v60.96,54.61 51.63,54.61 50.61,55.63 37.65,55.63 32.29,60.98 31.21,60.98 30.45,60.23 30.45,57.12 v27.94,54.61
BDIR  (via drill 0.35)
  Top 0.406: v82.55,77.47 70.03,89.99 55.37,89.99 53.65,88.27 53.65,82.95 55.88,80.72 U$10.11 | v83.82,58.42 85.09,58.42 U$8.24
  Bottom 0.406: v82.55,77.47 83.82,76.2 v83.82,58.42
BPWM
  Top 0.406: U$10.12 55.88,82.88 54.33,84.43 54.33,88.04 55.34,89.05 69.7,89.05 84.68,74.07 84.68,61.81 86.36,60.13 U$8.25
D0  (via drill 0.35)
  Top 0.406: U1.2 45.18,52.8 42.88,52.8 42.45,52.37 42.45,50.07 v31.75,39.37 | v19.05,20.32 U$11.16
  Bottom 0.406: v19.05,20.32 19.05,26.67 21.87,29.49 21.87,37.69 30.07,37.69 v31.75,39.37
D1  (via drill 0.35)
  Top 0.406: U$11.7 v40.64,10.16 | v53.34,46.99 53.34,50.8 U1.3
  Bottom 0.406: v40.64,10.16 40.64,32.23 42.47,34.06 42.47,34.79 48.32,40.64 50.99,40.64 51.71,41.36 51.71,45.36 v53.34,46.99
D2  (via drill 0.35)
  Top 0.406: U1.9 45.92,35.76 36.69,35.76 v36.51,35.94 | v36.63,22.86 U$11.17
  Bottom 0.406: v36.63,22.86 36.43,23.07 36.43,35.86 v36.51,35.94
D3  (via drill 0.35)
  Top 0.406: U$11.6 23.59,9.43 21.29,9.43 17.78,12.93 v17.78,17.78 | v21.59,41.91 22.86,43.18 v22.86,44.45 | v41.91,44.45 39.09,41.63 36.35,41.63 36.35,39.27 45.14,39.27 46.51,40.64 50.74,40.64 52.01,41.91 52.51,41.91 56.07,45.47 58.23,45.47 59.25,44.45 v59.69,44.45
  Bottom 0.406: v21.59,41.91 20.32,40.64 18.38,40.64 17.78,40.05 v17.78,17.78 | v22.86,44.45 v41.91,44.45 | v59.69,44.45 58.83,43.59 58.83,41.49 58.23,40.89 56.13,40.89 v52.07,36.83 U1.10
D6  (via drill 0.35)
  Top 0.406: U$11.19 33.25,25.4 33.99,24.67 37.56,24.67 v38.1,24.13 | v46.99,46.99 U1.6
  Bottom 0.406: v38.1,24.13 38.1,38.1 v46.99,46.99
D7  (via drill 0.35)
  Top 0.406: U1.7 48.39,44.45 44.83,40.89 38.35,40.89 v38.1,40.64 | v36.83,6.35 37.37,5.81 39.67,5.81 40.1,5.38 40.1,4.78 39.14,3.81 v30.48,3.81
  Bottom 0.406: v38.1,40.64 38.1,38.89 37.37,38.16 37.37,6.89 v36.83,6.35 | v30.48,3.81 29.23,2.56 29.23,2 28.48,1.25 24.86,1.25 24.11,2 24.11,3.08 25.4,4.37 U$11.4
GND  (via drill 0.35)  (3 unrouted)
  Top 0.406: U$10.1 45.74,85.11 42.64,85.11 34.25,76.72 U$5.P$2 | U$9.P$2 71.72,79.37 71.72,80.85 64.94,87.63 U$10.14 | U$1.5.GND 6.51,67.15 v7.62,66.04 | C2.2 28.5,29.21 28.48,29.23 26.7,29.23 U$11.22 | U1.8 49.97,41.91 56.07,48.01 63.48,48.01 64.47,48.99 65.07,48.99 65.5,48.56 65.5,45.02 58.84,38.35 58.67,38.35 U1.19 59.69,39.37 C3.- | U1.27 C1.2 | U$4.3 29.94,56.42 29.94,57.45 29.51,57.88 17.95,57.88 15.95,55.88 U$3.2
  pour Bottom (isolate 0): 0,0 100.33,0 100.33,100.33 0,100.33
MCLR
  Top 0.406: U1.1 U$4.1 29.25,62.19 U$5.P$1 R2.1
N$1  (via drill 0.35)
  Top 0.406: LED1.K v16.51,73.66 | v16.51,60.96 R1.2
  Bottom 0.406: v16.51,73.66 v16.51,60.96
N$2
  Top 0.406: U1.20 62.23,44.45 C3.+
N$3
  Top 0.406: J1.2 46.99,83.82 U$10.3
N$4
  Top 0.406: LED2.A 90.17,46.99 91.44,48.26 90.17,49.53 U$8.21
N$5
  Top 0.406: R6.1 71.16,79.97 U$9.P$1 71.16,74.89 U$8.1
N$7
  Top 0.406: J1.1 46.99,81.28 U$10.4
N$8
  Top 0.406: J2.2 U$10.5
N$9
  Top 0.406: J2.1 U$10.6
N$10
  Top 0.406: J3.1 U$11.20
N$11
  Top 0.406: J4.1 U$11.15
N$12
  Top 0.406: J5.1 U$11.9
N$13
  Top 0.406: U$8.28 90.17,63.5 J13.1
N$14
  Top 0.406: J14.1 90.17,56.59 88.88,57.88 88.88,62.26 U$8.27
N$15
  Top 0.406: U$8.26 88.32,60.27 88.32,55.9 90.17,54.05 J15.1
N$16
  Top 0.406: J6.1 U$8.2
N$17
  Top 0.406: U$8.3 J7.1
N$18
  Top 0.406: J8.1 U$8.4
N$19
  Top 0.406: U$8.5 J9.1
N$20
  Top 0.406: U$8.6 J10.1
N$21
  Top 0.406: J11.1 U$8.7
N$22
  Top 0.406: U$8.8 J12.1
N$23  (4 unrouted)
N$24  (4 unrouted)
N$25  (4 unrouted)
N$26  (4 unrouted)
N$27  (4 unrouted)
N$28  (4 unrouted)
N$29  (4 unrouted)
N$30  (4 unrouted)
N$31  (4 unrouted)
N$32  (4 unrouted)
N$33  (4 unrouted)
N$34  (4 unrouted)
N$35  (4 unrouted)
N$36  (4 unrouted)
N$37  (4 unrouted)
N$38  (4 unrouted)
RCK  (via drill 0.35)
  Top 0.406: v57.15,35.56 57.4,35.81 61.38,35.81 67.31,41.74 v67.31,53.34 | v8.16,31.81 8.16,29.94 8.33,29.77 8.33,29.21 v8.16,29.21 | v13.97,11.43 16.49,13.95 16.49,18.32 17.25,19.07 18.32,19.07 19.61,17.78 U$11.14
  Bottom 0.406: U1.12 53.34,35.56 v57.15,35.56 | v67.31,53.34 66.62,54.03 66.62,59.27 56.02,69.87 30.31,69.87 17.61,57.17 12.16,57.17 11.4,56.42 11.4,49.78 6.63,45.01 6.63,43.13 8.89,40.87 8.89,32.54 v8.16,31.81 | v8.16,29.21 8.16,17.24 v13.97,11.43
RRST  (via drill 0.35)
  Top 0.406: v52.17,37.99 52.17,37.76 52.8,37.13 52.8,31.02 v53.34,30.48 | v53.34,68.58 51.21,66.45 51.21,59.27 50.61,58.67 47.24,58.67 v34.29,45.72 | v22.86,15.24 U$11.12
  Bottom 0.406: U1.21 56.69,41.45 55.9,41.45 52.55,38.1 52.07,38.1 v52.17,37.99 | v53.34,68.58 53.34,66.39 65.5,54.22 65.5,47.96 60.98,43.44 60.98,28.2 58.44,25.65 55.9,25.65 51.1,20.86 50.5,20.86 50.07,21.29 50.07,24.22 53.34,27.5 v53.34,30.48 | v34.29,45.72 34.83,45.18 42.21,45.18 42.64,44.75 42.64,44.15 41.52,43.02 19.72,43.02 15.78,39.09 15.78,7.32 18.75,4.35 19.35,4.35 19.78,4.78 19.78,12.16 v22.86,15.24
V+
  Top 0.406: U$2.3 BAT.2
VIN  (via drill 0.35)  (7 unrouted)
  Top 0.406: J29.8 v45.72,22.86 | U$2.2 12.14,54.61 12.16,54.59 16.48,54.59 U$3.3 18.49,55.88 19.78,57.17 20.86,57.17 20.88,57.15 v29.21,57.15 v29.21,53.34 | U$10.2 48.26,84.38 49.55,83.09 49.55,71.85 48.8,71.09 38.08,71.09 v31.75,64.77 | v50.8,30.48 50.8,30.92 51.21,31.33 51.21,38.06 56.07,42.93 59.44,42.93 v64.77,48.26
  Bottom 0.406: 41.49,30.73 41.82,30.73 42.08,30.48 45.72,30.48 | v29.21,57.15 29.21,62.23 v31.75,64.77 | v29.21,53.34 27.71,53.34 26.97,52.61 25.1,52.61 24.67,53.04 24.67,59.51 31.21,66.06 52.88,66.06 62.96,55.97 62.96,50.07 v64.77,48.26 | v50.8,30.48 45.72,30.48 | v45.72,22.86 45.72,30.48
VSY  (via drill 0.35)
  Top 0.406: U$11.3 v39.37,5.08 | v41.91,35.02 42.09,34.85 44.68,34.85 45.24,34.29 U1.11
  Bottom 0.406: v39.37,5.08 39.37,31.75 41.91,34.29 v41.91,35.02
WR  (via drill 0.35)
  Top 0.406: v50.8,23.59 51.98,23.59 56.07,27.69 58.23,27.69 60.82,25.09 79.7,25.09 v80.01,25.4 | v7.62,44.45 7.62,32.31 5.05,29.75 5.05,15.97 5.81,15.21 6.38,15.21 v19.05,2.54
  Bottom 0.406: U1.14 52.61,29.75 52.61,30.78 53.04,31.21 53.64,31.21 54.07,30.78 54.07,27.44 50.8,24.17 v50.8,23.59 50.8,22.86 | v80.01,25.4 78.49,26.92 77.05,26.92 66.06,37.91 66.06,57.29 65.19,58.17 64.79,58.17 53.77,69.19 30.92,69.19 23.11,61.38 23.11,56.84 10.72,44.45 v7.62,44.45 | v19.05,2.54 20.86,4.35 20.86,10.46 21.59,11.2 21.59,12.7 U$11.10
WRST  (via drill 0.35)
  Top 0.406: v50.8,21.59 48.82,21.59 48.8,21.61 47.72,21.61 47.7,21.59 v46.99,21.59 | v41.91,15.24 U$11.11
  Bottom 0.406: v50.8,21.59 55.47,26.26 55.47,27.09 56.07,27.69 57.72,27.69 58.83,28.79 58.83,38.95 60.42,40.55 60.42,44.75 59.99,45.18 59.39,45.18 58.65,44.45 U1.22 | v46.99,21.59 47.7,21.59 47.72,21.61 48.8,21.61 49.55,20.86 49.55,2 48.8,1.25 45.18,1.25 44.42,2 44.42,12.72 v41.91,15.24

### Text on the board
tPlace: Adam Pelberg | ME 433 Advanced Mechatronics | B | A | + | - | GND | 3.3V | VIN | GND